# Altium schematic sheet 04_Temperature.SchDoc
size A4; DocumentNumber: 4; SheetNumber: 4; SheetTotal: 7
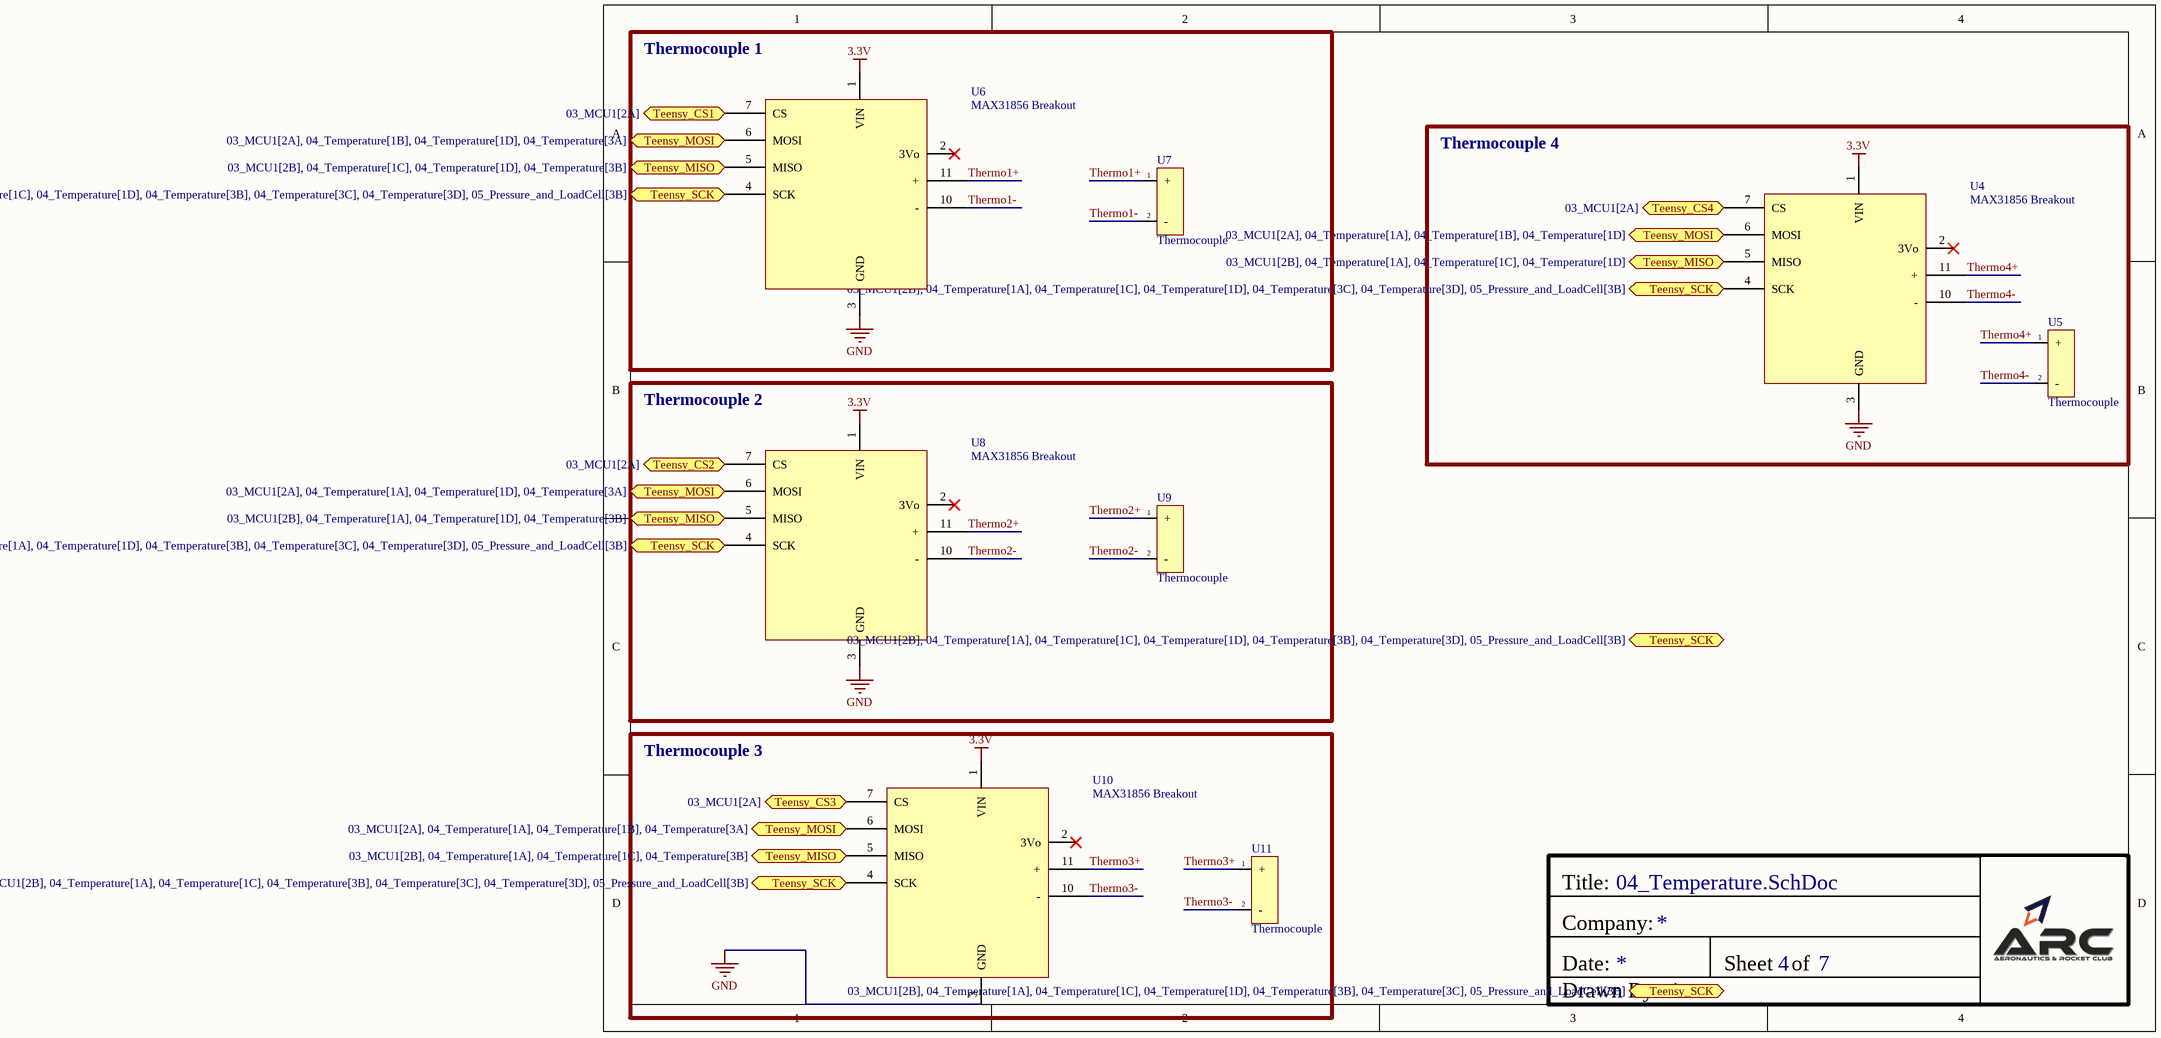
[diagram p0: 04_Temperature.SchDoc]

## Parts
U4  MAX31856 Breakout  [MAX31856 Breakout]
U5  Thermocouple  [THERMOCOUPLE]
U6  MAX31856 Breakout  [MAX31856 Breakout]
U7  Thermocouple  [THERMOCOUPLE]
U8  MAX31856 Breakout  [MAX31856 Breakout]
U9  Thermocouple  [THERMOCOUPLE]
U10  MAX31856 Breakout  [MAX31856 Breakout]
U11  Thermocouple  [THERMOCOUPLE]

## Blocks framed on the sheet
Thermocouple 1: U6 U7
Thermocouple 4: U4 U5
Thermocouple 2: U8 U9
Thermocouple 3: U10 U11

## Ports
Teensy_CS1 (bidir, see 03_MCU1[2A]), Teensy_CS2 (bidir, see 03_MCU1[2A]), Teensy_CS3 (bidir, see 03_MCU1[2A]), Teensy_CS4 (bidir, see 03_MCU1[2A]), Teensy_MISO (bidir, see 03_MCU1[2B], 04_Temperature[1A], 04_Temperature[1C], 04_Temperature[1D]), Teensy_MISO (bidir, see 03_MCU1[2B], 04_Temperature[1A], 04_Temperature[1C], 04_Temperature[3B]), Teensy_MISO (bidir, see 03_MCU1[2B], 04_Temperature[1A], 04_Temperature[1D], 04_Temperature[3B]), Teensy_MISO (bidir, see 03_MCU1[2B], 04_Temperature[1C], 04_Temperature[1D], 04_Temperature[3B]), Teensy_MOSI (bidir, see 03_MCU1[2A], 04_Temperature[1A], 04_Temperature[1B], 04_Temperature[1D]), Teensy_MOSI (bidir, see 03_MCU1[2A], 04_Temperature[1A], 04_Temperature[1B], 04_Temperature[3A]), Teensy_MOSI (bidir, see 03_MCU1[2A], 04_Temperature[1A], 04_Temperature[1D], 04_Temperature[3A]), Teensy_MOSI (bidir, see 03_MCU1[2A], 04_Temperature[1B], 04_Temperature[1D], 04_Temperature[3A]), Teensy_SCK (bidir, see 03_MCU1[2B], 04_Temperature[1A], 04_Temperature[1C], 04_Temperature[1D], 04_Temperature[3B], 04_Temperature[3C], 05_Pressure_and_LoadCell[3B]), Teensy_SCK (bidir, see 03_MCU1[2B], 04_Temperature[1A], 04_Temperature[1C], 04_Temperature[1D], 04_Temperature[3B], 04_Temperature[3D], 05_Pressure_and_LoadCell[3B]), Teensy_SCK (bidir, see 03_MCU1[2B], 04_Temperature[1A], 04_Temperature[1C], 04_Temperature[1D], 04_Temperature[3C], 04_Temperature[3D], 05_Pressure_and_LoadCell[3B]), Teensy_SCK (bidir, see 03_MCU1[2B], 04_Temperature[1A], 04_Temperature[1C], 04_Temperature[3B], 04_Temperature[3C], 04_Temperature[3D], 05_Pressure_and_LoadCell[3B]), Teensy_SCK (bidir, see 03_MCU1[2B], 04_Temperature[1A], 04_Temperature[1D], 04_Temperature[3B], 04_Temperature[3C], 04_Temperature[3D], 05_Pressure_and_LoadCell[3B]), Teensy_SCK (bidir, see 03_MCU1[2B], 04_Temperature[1C], 04_Temperature[1D], 04_Temperature[3B], 04_Temperature[3C], 04_Temperature[3D], 05_Pressure_and_LoadCell[3B])

## Nets
3.3V: U4.1(VIN) U6.1(VIN) U8.1(VIN) U10.1(VIN)
GND: U4.3(GND) U6.3(GND) U8.3(GND) U10.3(GND)
Teensy_CS1: U6.7(CS) ; port Teensy_CS1
Teensy_CS2: U8.7(CS) ; port Teensy_CS2
Teensy_CS3: U10.7(CS) ; port Teensy_CS3
Teensy_CS4: U4.7(CS) ; port Teensy_CS4
Teensy_MISO: U4.5(MISO) U6.5(MISO) U8.5(MISO) U10.5(MISO) ; port Teensy_MISO
Teensy_MOSI: U4.6(MOSI) U6.6(MOSI) U8.6(MOSI) U10.6(MOSI) ; port Teensy_MOSI
Teensy_SCK: U4.4(SCK) U6.4(SCK) U8.4(SCK) U10.4(SCK) ; port Teensy_SCK
Thermo1+: U6.11(+) U7.1(+)
Thermo1-: U6.10(-) U7.2(-)
Thermo2+: U8.11(+) U9.1(+)
Thermo2-: U8.10(-) U9.2(-)
Thermo3+: U10.11(+) U11.1(+)
Thermo3-: U10.10(-) U11.2(-)
Thermo4+: U4.11(+) U5.1(+)
Thermo4-: U4.10(-) U5.2(-)

Not connected (* = marked no-connect by the designer): U4 2(3Vo)*; U6 2(3Vo)*; U8 2(3Vo)*; U10 2(3Vo)*

## Notes on the sheet
- Title:
- Company:
- Date:
- Sheet
- of
- Drawn By:

## Library data of the parts
U4 U6 U8 U10 = MAX31856 Breakout: Thermocouple amplifier works with any K, J, N, R, S, T, E, or B type thermocouple -210°C to +1800°C output in 0.0078125° resolution 3.3 to 5v power supply and logic level compliant SPI protocol